# Altium project Ethernet_PCB.PrjPcb (part 2 of 2)

## Sheet Power Management.SchDoc
size A; SheetNumber: 4; SheetTotal: 7
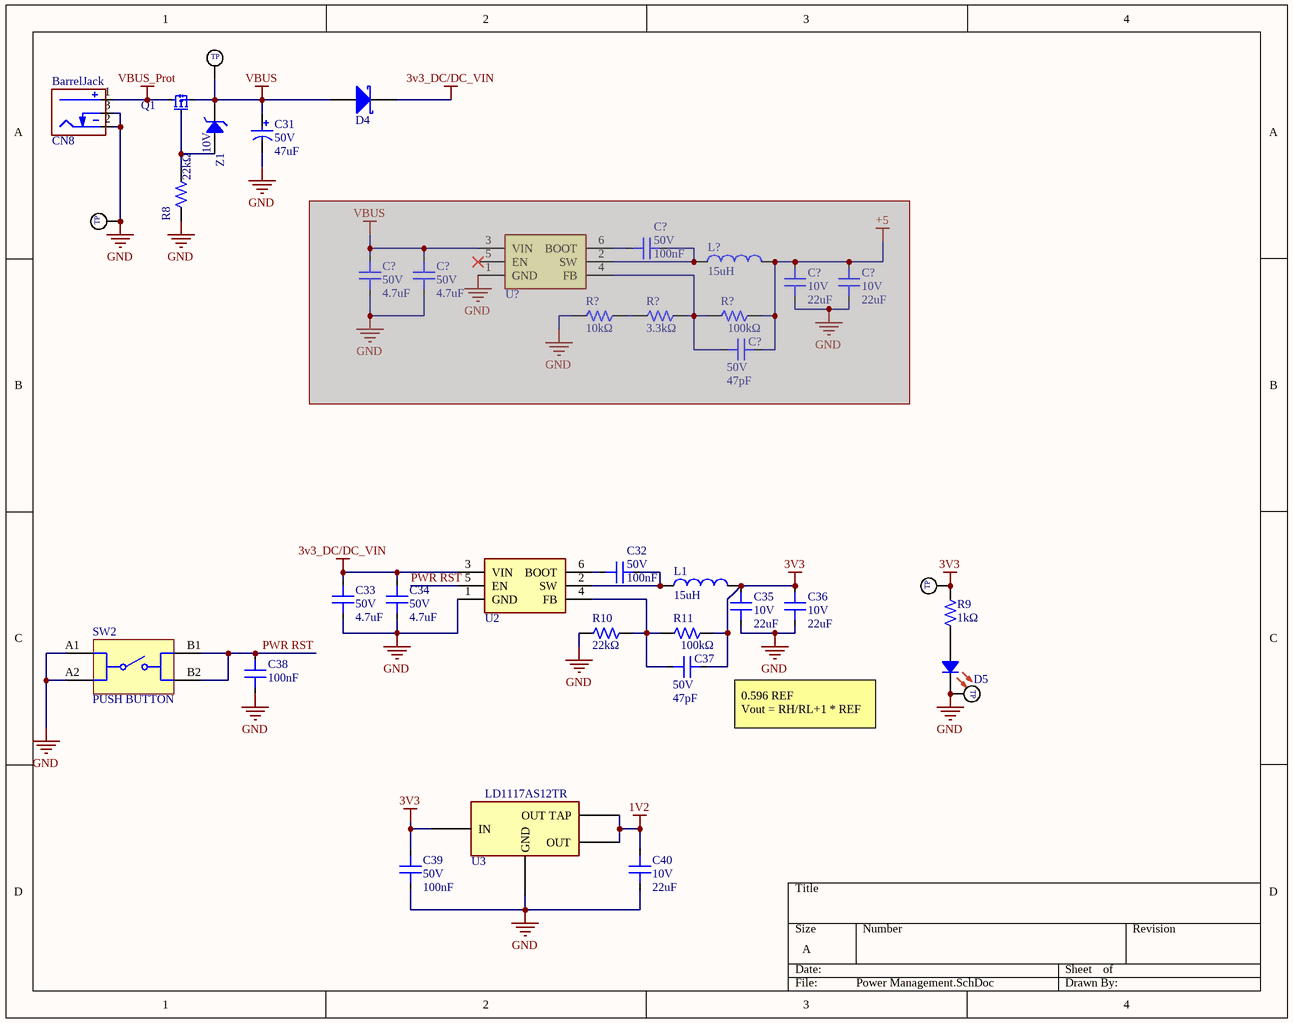
[diagram p4: Power Management.SchDoc]

### Parts
(Parts that share a designator on the sheet are numbered #1, #2 ... from top to bottom, then left to right.)
C31  Voltage Rating: 50V  Capacitance: 47uF  [CAP TH ALUM ELEC D6.30mm S2.50mm H11.00mm]  (hidden comment: CAP ALUM 47uF ±20% 50V TH)
C32  Voltage Rating: 50V  Capacitance: 100nF  [C_0603]  (hidden comment: CAP CER 100nF 50V X7R 0603)
C33  Voltage Rating: 50V  Capacitance: 4.7uF  [C_1206]  (hidden comment: CAP CER 4.7uF 50V X7R 1206)
C34  Voltage Rating: 50V  Capacitance: 4.7uF  [C_1206]  (hidden comment: CAP CER 4.7uF 50V X7R 1206)
C35  Voltage Rating: 10V  Capacitance: 22uF  [C_1206]  (hidden comment: CAP CER 22uF 10V X7R 1206)
C36  Voltage Rating: 10V  Capacitance: 22uF  [C_1206]  (hidden comment: CAP CER 22uF 10V X7R 1206)
C37  Voltage Rating: 50V  Capacitance: 47pF  [C_0603]  (hidden comment: CAP CER 47pF 50V C0G 0603)
C38  Capacitance: 100nF  [C_0603]  (hidden comment: CAP CER 100nF 50V X7R 0603)
C39  Voltage Rating: 50V  Capacitance: 100nF  [C_0603]  (hidden comment: CAP CER 100nF 50V X7R 0603)
C40  Voltage Rating: 10V  Capacitance: 22uF  [C_1206]  (hidden comment: CAP CER 22uF 10V X7R 1206)
C?#1  Voltage Rating: 50V  Capacitance: 100nF  [C_0603]  (hidden comment: CAP CER 100nF 50V X7R 0603)  (masked out: inside a compile mask, not in the netlist)
C?#2  Voltage Rating: 50V  Capacitance: 4.7uF  [C_1206]  (hidden comment: CAP CER 4.7uF 50V X7R 1206)  (masked out: inside a compile mask, not in the netlist)
C?#3  Voltage Rating: 50V  Capacitance: 4.7uF  [C_1206]  (hidden comment: CAP CER 4.7uF 50V X7R 1206)  (masked out: inside a compile mask, not in the netlist)
C?#4  Voltage Rating: 10V  Capacitance: 22uF  [C_1206]  (hidden comment: CAP CER 22uF 10V X7R 1206)  (masked out: inside a compile mask, not in the netlist)
C?#5  Voltage Rating: 10V  Capacitance: 22uF  [C_1206]  (hidden comment: CAP CER 22uF 10V X7R 1206)  (masked out: inside a compile mask, not in the netlist)
C?#6  Voltage Rating: 50V  Capacitance: 47pF  [C_0603]  (hidden comment: CAP CER 47pF 50V C0G 0603)  (masked out: inside a compile mask, not in the netlist)
CN8  CONN PWR JACK 2mm x 6.4mm TH R/A  [CONN_DC-POWER-JACK_TH_RA]  (value not drawn)
D4  DIODE SCHOTTKY 40V SOD-323  [SOD323]  (value not drawn)
D5  LED RED WATER CLEAR 0603 SMD  [LED_0603]  (value not drawn)
L1  Inductance: 15uH  [IND_SMD,4.7X4.7MM]  (hidden comment: FIXED IND 15uH 0.76A 149mΩ SMD,4.7x4.7mm)
L?  Inductance: 15uH  [IND_SMD,4.7X4.7MM]  (hidden comment: FIXED IND 15uH 0.76A 149mΩ SMD,4.7x4.7mm)  (masked out: inside a compile mask, not in the netlist)
Q1  MOSFET P-CH 30V 4A SOT-23  [SOT23]  (value not drawn)
R8  Resistance: 22kΩ  [R_0603]  (hidden comment: RES 22kΩ ±1% 100mW 0603)
R9  Resistance: 1kΩ  [R_0603]  (hidden comment: RES 1kΩ ±1% 100mW 0603)
R10  Resistance: 22kΩ  [R_0603]  (hidden comment: RES 22kΩ ±1% 100mW 0603)
R11  Resistance: 100kΩ  [R_0603]  (hidden comment: RES 100kΩ ±1% 100mW 0603)
R?#1  Resistance: 10kΩ  [R_0603]  (hidden comment: RES 10kΩ ±1% 100mW 0603)  (masked out: inside a compile mask, not in the netlist)
R?#2  Resistance: 3.3kΩ  [R_0603]  (hidden comment: RES 3.3kΩ ±1% 100mW 0603)  (masked out: inside a compile mask, not in the netlist)
R?#3  Resistance: 100kΩ  [R_0603]  (hidden comment: RES 100kΩ ±1% 100mW 0603)  (masked out: inside a compile mask, not in the netlist)
SW2  PUSH BUTTON  [Tact Switch 6X6X9.5MM]
TP1  TestPoint TH  [TESTPOINT_TH_MINIATURE]  (value not drawn)
TP2  TestPoint TH  [TESTPOINT_TH_MINIATURE]  (value not drawn)
TP3  TestPoint TH  [TESTPOINT_TH_MINIATURE]  (value not drawn)
TP4  TestPoint TH  [TESTPOINT_TH_MINIATURE]  (value not drawn)
U2  4.5-V to 28-V Input, 3-A Output, EMI-Friendly Synchronous Step-Down Converter  [TSOT-23-6]  (value not drawn)
U3  Low Dropout Fixed and Adjustable Positive Voltage Regulators  [SOT-223-4]  (value not drawn)
U?  4.5-V to 28-V Input, 3-A Output, EMI-Friendly Synchronous Step-Down Converter  [TSOT-23-6]  (value not drawn)  (masked out: inside a compile mask, not in the netlist)
Z1  Zener Voltage: 10V  [SOD123]  (hidden comment: DIODE ZENER 10V 500mW SOD-123)

### Nets
1V2: C40.2 U3.2(OUT) U3.4(OUT_TAP)  [project net VDD_1.2A]
3V3: C35.2 C36.2 C37.2 C39.2 L1.2 R9.1 R11.2 TP3.1 U3.3(IN)  [project net VDD33]
3v3_DC/DC_VIN: C33.1 C34.1 D4.2(K) U2.3(VIN)
GND: C31.2 C33.2 C34.2 C35.1 C36.1 C38.1 C39.1 C40.1 CN8.2(Outer) CN8.3(SW) D5.2 R8.1 R10.1 SW2.A1 SW2.A2 TP2.1 TP4.1 U2.1(GND) U3.1(GND)
VBUS: C31.1 D4.1(A) Q1.2(SOURCE) TP1.1 Z1.2
VBUS_Prot: CN8.1(Centre) Q1.3(DRAIN)
PWR RST: C38.2 SW2.B1 SW2.B2 U2.5(EN)
NetC32_1: C32.1 U2.6(BOOT)
NetC32_2: C32.2 L1.1 U2.2(SW)
NetC37_1: C37.1 R10.2 R11.1 U2.4(FB)
NetD5_1: D5.1 R9.2
NetQ1_1: Q1.1(GATE) R8.2 Z1.1

### Notes on the sheet
- 0.596 REF
  Vout = RH/RL+1 * REF
- (in symbol 5000) TP

### Library data of the parts
C31 = ERS1HM470E110T: 47uF 50V Aluminum Electrolytic Capacitors Through Hole,D6.3xL11mm 5000hrs@105℃; Manufacturer: AISHI; Symbol Path 1: Symbols\Standard.SchLib; Unit Price (USD): 0.0351; MPN: ERS1HM470E110T; LCSC Part #: C106665; Package: THROUGH HOLE,D6.3XL11MM; JLC Part Type: Extended; LCSC Stock: 162380; JLC Stock: 171488; MOQ: 20; Datasheet: https://datasheet.lcsc.com/datasheet/pdf/b0168805bce6925b8870af550341b247.pdf?productCode=C106665; URL: https://www.lcsc.com/product-detail/C106665.html; Status: ok; Tolerance: ±20%; Lifetime: 5000hrs@105℃; Subcategory: Aluminum Electrolytic Capacitors
C32 C39 C?#1 = C14663: 100nF ±10% 50V Ceramic Capacitor X7R 0603; Manufacturer: YAGEO; MPN: CC0603KRX7R9BB104; Symbol Path 1: Symbols\Standard.SchLib; Unit Price (USD): 0.0175; LCSC Part #: C14663; Package: 0603; JLC Part Type: Basic; LCSC Stock: 10701000; JLC Stock: 72739428; MOQ: 50; Datasheet: https://datasheet.lcsc.com/datasheet/pdf/23ccee80ee542e7cf156a772bb589942.pdf?productCode=C14663; URL: https://www.lcsc.com/product-detail/C14663.html; Status: ok; Tolerance: ±10%; TempCo: X7R
C33 C34 C?#2 C?#3 = C29823: 4.7uF ±10% 50V Ceramic Capacitor X7R 1206; Manufacturer: FH; MPN: 1206B475K500NT; Symbol Path 1: Symbols\Standard.SchLib; Unit Price (USD): 0.2723; LCSC Part #: C29823; Package: 1206; JLC Part Type: Basic; LCSC Stock: 428640; JLC Stock: 942034; MOQ: 10; Datasheet: https://datasheet.lcsc.com/datasheet/pdf/09fe2daf22580a99fa7fea93ccb20fb7.pdf?productCode=C29823; URL: https://www.lcsc.com/product-detail/C29823.html; Status: ok; Tolerance: ±10%; TempCo: X7R
C35 C36 C40 C?#4 C?#5 = C87996: 22uF ±10% 10V Ceramic Capacitor X7R 1206; Manufacturer: Samsung Electro-Mechanics; MPN: CL31B226KPHNNNE; Symbol Path 1: Symbols\Standard.SchLib; Unit Price (USD): 0.1794; LCSC Part #: C87996; Package: 1206; JLC Part Type: Extended; LCSC Stock: 223920; JLC Stock: 305356; MOQ: 5; Datasheet: https://datasheet.lcsc.com/datasheet/pdf/02336ea48ea44ca18c72517dd3cb7b47.pdf?productCode=C87996; URL: https://www.lcsc.com/product-detail/C87996.html; Status: ok; Tolerance: ±10%; TempCo: X7R
C37 C?#6 = C1671: 47pF ±5% 50V Ceramic Capacitor C0G 0603; Manufacturer: Samsung Electro-Mechanics; MPN: CL10C470JB8NNNC; Symbol Path 1: Symbols\Standard.SchLib; Unit Price (USD): 0.011; LCSC Part #: C1671; Package: 0603; JLC Part Type: Basic; LCSC Stock: 658700; JLC Stock: 1229214; MOQ: 100; Datasheet: https://datasheet.lcsc.com/datasheet/pdf/02336ea48ea44ca18c72517dd3cb7b47.pdf?productCode=C1671; URL: https://www.lcsc.com/product-detail/C1671.html; Status: ok; Tolerance: ±5%; TempCo: C0G
C38 = CC0603KRX7R9BB104: 100nF ±10% 50V Ceramic Capacitor X7R 0603; Manufacturer: YAGEO; Symbol Path 1: Symbols\Standard.SchLib; Unit Price (USD): 0.0175; Voltage Rating: 50V; MPN: CC0603KRX7R9BB104; LCSC Part #: C14663; Package: 0603; JLC Part Type: Basic; LCSC Stock: 10701000; JLC Stock: 72739428; MOQ: 50; Datasheet: https://datasheet.lcsc.com/datasheet/pdf/23ccee80ee542e7cf156a772bb589942.pdf?productCode=C14663; URL: https://www.lcsc.com/product-detail/C14663.html; Status: ok; Tolerance: ±10%; TempCo: X7R
CN8 = DC-005-A200: Power Barrel Connector Jack 2mm ID 6.4mm OD Through Hole, Right Angle; Manufacturer: XUNPU; Symbol Path 1: Symbols\Standard_CONN.SchLib; Unit Price (USD): 0.1442; MPN: DC-005-A200; LCSC Part #: C720557; Package: THROUGH HOLE; JLC Part Type: Extended; LCSC Stock: 71145; JLC Stock: 71145; MOQ: 5; Datasheet: https://datasheet.lcsc.com/datasheet/pdf/c2acc7caa29ac1d040564d55b702c9cb.pdf?productCode=C720557; URL: https://www.lcsc.com/product-detail/C720557.html; Status: ok
D4 = 1N5819WS: Diode 40V 1A Surface Mount SOD-323; Manufacturer: Guangdong Hottech; Symbol Path 1: Symbols\Standard.SchLib; Unit Price (USD): 0.0139; Forward Voltage: 600mV@1A; MPN: 1N5819WS; LCSC Part #: C191023; Package: SOD-323; JLC Part Type: Basic; LCSC Stock: 4984450; JLC Stock: 5626571; MOQ: 50; Datasheet: https://datasheet.lcsc.com/datasheet/pdf/c7a6590686b7be2f86b8eed4480e569c.pdf?productCode=C191023; URL: https://www.lcsc.com/product-detail/C191023.html; Status: ok; Voltage Rating: 40V; Current Rating: 1A; Subcategory: Schottky
D5 = XL-1608SURC-06: Red 625nm LED Indication - Discrete 2.3V 0603; Manufacturer: XINGLIGHT; Symbol Path 1: Symbols\Standard.SchLib; Unit Price (USD): 0.0035; Forward Current: 20mA; Luminous: 225mcd; MPN: XL-1608SURC-06; LCSC Part #: C965799; Package: 0603; JLC Part Type: Extended; LCSC Stock: 7400800; JLC Stock: 7400861; MOQ: 100; Datasheet: https://datasheet.lcsc.com/datasheet/pdf/8b84af6e65674f776ac713f2807c626a.pdf?productCode=C965799; URL: https://www.lcsc.com/product-detail/C965799.html; Status: ok; Colour: Red; Forward Voltage: 2.3V
L1 L? = XRRH4D28-150M: Manufacturer: XR; Symbol Path 1: Symbols\Standard.SchLib; Unit Price (USD): 0.1057; Tolerance: ±20%; Rated Current: 760mA; MPN: XRRH4D28-150M; LCSC Part #: C5351438; Package: SMD,4.7X4.7MM; JLC Part Type: Extended; LCSC Stock: 640; JLC Stock: 640; MOQ: 5; Datasheet: https://datasheet.lcsc.com/datasheet/pdf/86c679cf93a94dd1d57823f3427e60b9.pdf?productCode=C5351438; URL: https://www.lcsc.com/product-detail/C5351438.html; Status: ok; DC Resistance: 149mΩ
Q1 = AO3401A: 30V 4A Surface Mount SOT-23; Manufacturer: AOS; Symbol Path 1: Symbols\Standard.SchLib; Unit Price (USD): 0.0951; Rds: 47mΩ@10V;60mΩ@4.5V;85mΩ@2.5V; Vgs(th): 900mV; MPN: AO3401A; LCSC Part #: C15127; Package: SOT-23; JLC Part Type: Basic; LCSC Stock: 115510; JLC Stock: 469891; MOQ: 5; Datasheet: https://datasheet.lcsc.com/datasheet/pdf/fee353dd1e9e0bc90b295f14f381aa4c.pdf?productCode=C15127; URL: https://www.lcsc.com/product-detail/C15127.html; Status: ok; Vds: 30V; Id: 4A
R8 R10 = C31850: 22kΩ ±1% 100mW 0603 Thick Film Resistor; MPN: 0603WAF2202T5E; Manufacturer: UNI-ROYAL; Symbol Path 1: Symbols\Standard.SchLib; Unit Price (USD): 0.0067; Voltage Rating: 75V; TempCo: ±100ppm/℃; LCSC Part #: C31850; Package: 0603; Datasheet: https://datasheet.lcsc.com/datasheet/pdf/0a975aaa49b7c97f38a963127be4a823.pdf?productCode=C31850; Power: 100mW; JLC Part Type: Basic; LCSC Stock: 3044300; JLC Stock: 4293246; MOQ: 100; URL: https://www.lcsc.com/product-detail/C31850.html; Status: ok; Tolerance: ±1%; Composition: Thick Film Resistor
R9 = 0603WAF1001T5E: 1kΩ ±1% 100mW 0603 Thick Film Resistor; Manufacturer: UNI-ROYAL; Symbol Path 1: Symbols\Standard.SchLib; Unit Price (USD): 0.0058; Voltage Rating: 75V; TempCo: ±100ppm/℃; MPN: 0603WAF1001T5E; Package: 0603; Datasheet: https://datasheet.lcsc.com/datasheet/pdf/0a975aaa49b7c97f38a963127be4a823.pdf?productCode=C21190; Power: 100mW; LCSC Part #: C21190; JLC Part Type: Basic; LCSC Stock: 7626000; JLC Stock: 31254885; MOQ: 100; URL: https://www.lcsc.com/product-detail/C21190.html; Status: ok; Tolerance: ±1%; Composition: Thick Film Resistor
R11 R?#3 = C25803: 100kΩ ±1% 100mW 0603 Thick Film Resistor; MPN: 0603WAF1003T5E; Manufacturer: UNI-ROYAL; Symbol Path 1: Symbols\Standard.SchLib; Unit Price (USD): 0.0042; Voltage Rating: 75V; TempCo: ±100ppm/℃; LCSC Part #: C25803; Package: 0603; Datasheet: https://datasheet.lcsc.com/datasheet/pdf/0a975aaa49b7c97f38a963127be4a823.pdf?productCode=C25803; Power: 100mW; JLC Part Type: Basic; LCSC Stock: 13059500; JLC Stock: 21549170; MOQ: 100; URL: https://www.lcsc.com/product-detail/C25803.html; Status: ok; Tolerance: ±1%; Composition: Thick Film Resistor
R?#1 = 0603WAF1002T5E: 10kΩ ±1% 100mW 0603 Thick Film Resistor; Manufacturer: UNI-ROYAL; Symbol Path 1: Symbols\Standard.SchLib; Unit Price (USD): 0.0067; Voltage Rating: 75V; TempCo: ±100ppm/℃; MPN: 0603WAF1002T5E; Package: 0603; Datasheet: https://datasheet.lcsc.com/datasheet/pdf/0a975aaa49b7c97f38a963127be4a823.pdf?productCode=C25804; Power: 100mW; LCSC Part #: C25804; JLC Part Type: Basic; LCSC Stock: 0; JLC Stock: 6329063; MOQ: 100; URL: https://www.lcsc.com/product-detail/C25804.html; Status: ok; Tolerance: ±1%; Composition: Thick Film Resistor
R?#2 = 0603WAF3301T5E: 3.3kΩ ±1% 100mW 0603 Thick Film Resistor; Manufacturer: UNI-ROYAL; Symbol Path 1: Symbols\Standard.SchLib; Unit Price (USD): 0.005; Voltage Rating: 75V; TempCo: ±100ppm/℃; MPN: 0603WAF3301T5E; Package: 0603; Datasheet: https://datasheet.lcsc.com/datasheet/pdf/0a975aaa49b7c97f38a963127be4a823.pdf?productCode=C22978; Power: 100mW; LCSC Part #: C22978; JLC Part Type: Basic; LCSC Stock: 4987900; JLC Stock: 7018614; MOQ: 100; URL: https://www.lcsc.com/product-detail/C22978.html; Status: ok; Tolerance: ±1%; Composition: Thick Film Resistor
SW2 = SH-6X6X8H-CJ: SWITCH PUSH BUTTON 2X2 6X6X9.5MM; Supplier 1: LCSC; Supplier Part Number 1: C42416249; ComponentLink1Description: MAKERS; ComponentLink1URL: https://makerselectronics.com/product/mini-push-button-4-pin-6x6x9-5mm
TP1-TP4 = 5000: TestPoint TH MINIATURE; Supplier 1: Digikey; Supplier Part Number 1: 36-5000-ND; Supplier 2: LCSC; Supplier Part Number 2: C5277086
U2 U? = TPS54302DDCR: Buck Switching Regulator IC Adjustable 1 Output 3A TSOT-23-6; Manufacturer: TI; Symbol Path 1: Symbols\Standard_ICs.SchLib; Unit Price (USD): 0.3033; Input Voltage: 4.5V~28V; MPN: TPS54302DDCR; LCSC Part #: C311983; Package: TSOT-23-6; JLC Part Type: Extended; LCSC Stock: 4335; JLC Stock: 5216; MOQ: 5; Datasheet: https://datasheet.lcsc.com/datasheet/pdf/dd7a4984f2d3ca9a2264b937537aa471.pdf?productCode=C311983; URL: https://www.lcsc.com/product-detail/C311983.html; Status: ok; Subcategory: Voltage Regulators - DC DC Switching Regulators; Output Current: 3A
U3 = LD1117AS12TR: Manufacturer: ST; Symbol Path 1: Symbols\Standard_ICs.SchLib; Unit Price (USD): 0.3055; Output Voltage: 1.2V; Output Current: 1.2A; Input Voltage: 10V; MPN: LD1117AS12TR; LCSC Part #: C98193; Package: SOT-223; JLC Part Type: Extended; LCSC Stock: 2645; JLC Stock: 2647; MOQ: 5; Datasheet: https://datasheet.lcsc.com/datasheet/pdf/bad2b7c9a0104f7f93b9ca5f4bf0c704.pdf?productCode=C98193; URL: https://www.lcsc.com/product-detail/C98193.html; Status: ok; Subcategory: Voltage Regulators - Linear, Low Drop Out (LDO) Regulators
Z1 = MM1Z10B: Zener Diode Independent 10V 500mW Surface Mount SOD-123; Manufacturer: R+O; Symbol Path 1: Symbols\Standard.SchLib; Unit Price (USD): 0.0253; MPN: MM1Z10B; LCSC Part #: C22466341; Package: SOD-123; JLC Part Type: Extended; LCSC Stock: 58240; JLC Stock: 58248; MOQ: 20; Datasheet: https://datasheet.lcsc.com/datasheet/pdf/907cba31244dca3d738fcc4264c58834.pdf?productCode=C22466341; URL: https://www.lcsc.com/product-detail/C22466341.html; Status: ok; Subcategory: Zener

## Sheet USB Connectors.SchDoc
size A; SheetNumber: 5; SheetTotal: 7
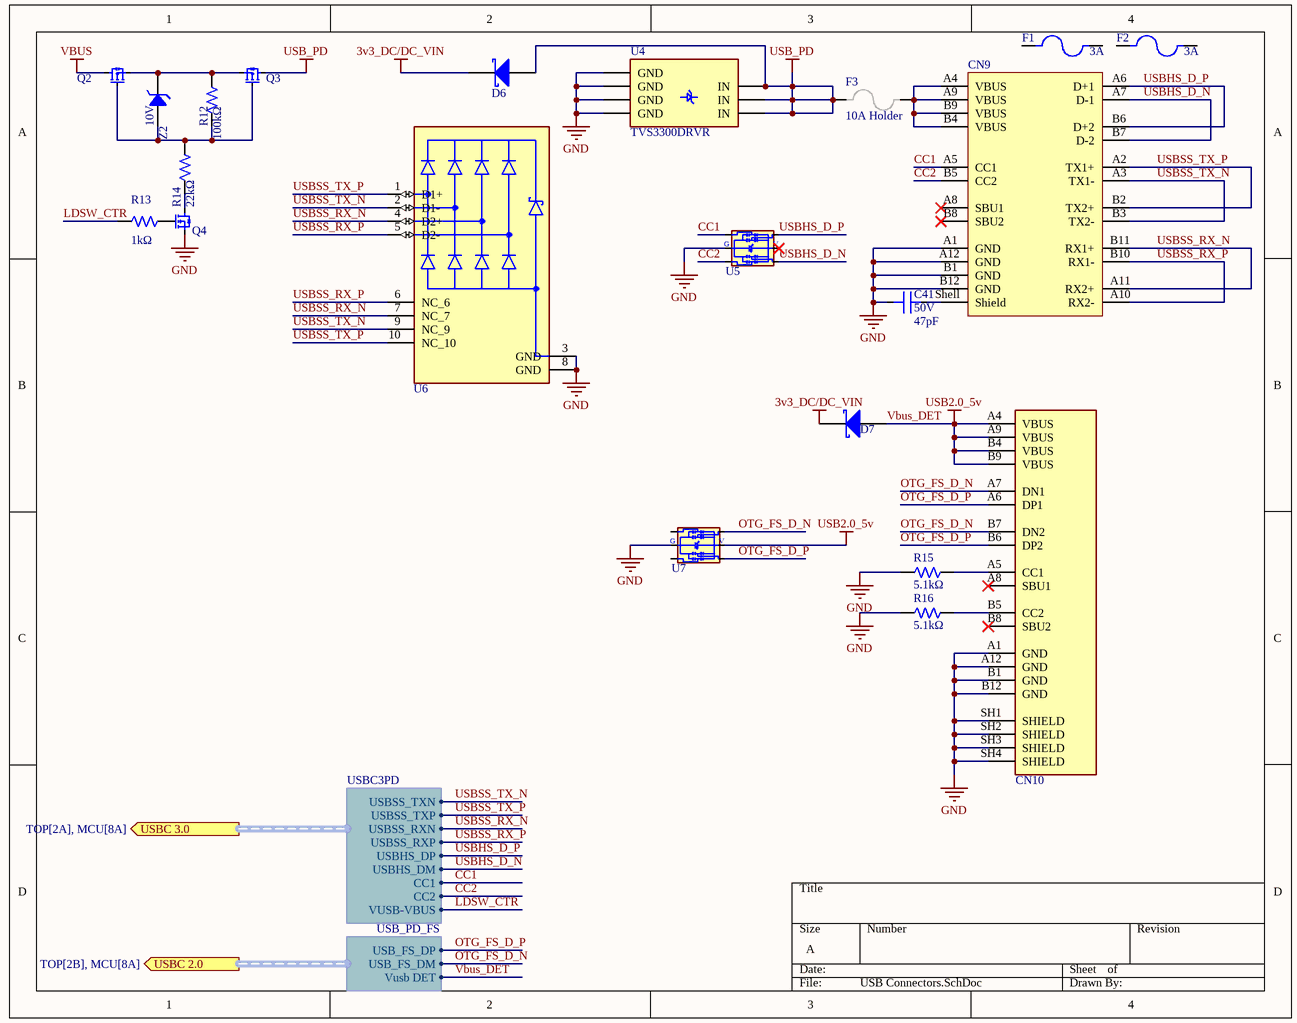
[diagram p5: USB Connectors.SchDoc]

### Parts
C41  Voltage Rating: 50V  Capacitance: 47pF  [C_0603]  (hidden comment: CAP CER 47pF 50V C0G 0603)
CN9  CONN RCPT USB 3.1 Type-C 24POS SMD R/A  [CONN_TYPE-C_24P_SMD_RA]  (value not drawn)
CN10  CONN RCPT USB 3.1 Type-C 16POS TH R/A  [CONN_TYPE-C_16P_TH_RA]  (value not drawn)
D6  DIODE SCHOTTKY 40V SOD-323  [SOD323]  (value not drawn)
D7  DIODE SCHOTTKY 40V SOD-323  [SOD323]  (value not drawn)
F1  3A  (mechanical)
F2  3A  (mechanical)
F3  10A Holder  [FUSE_SMD 2410 HOLDER]
Q2  MOSFET P-CH 30V 4A SOT-23  [SOT23]  (value not drawn)
Q3  MOSFET P-CH 30V 4A SOT-23  [SOT23]  (value not drawn)
Q4  MOSFET N-CH 30V SOT-23-3L  [SOT23]  (value not drawn)
R12  Resistance: 100kΩ  [R_0603]  (hidden comment: RES 100kΩ ±1% 100mW 0603)
R13  Resistance: 1kΩ  [R_0603]  (hidden comment: RES 1kΩ ±1% 100mW 0603)
R14  Resistance: 22kΩ  [R_0603]  (hidden comment: RES 22kΩ ±1% 100mW 0603)
R15  Resistance: 5.1kΩ  [R_0603]  (hidden comment: RES 5.1kΩ ±1% 100mW 0603)
R16  Resistance: 5.1kΩ  [R_0603]  (hidden comment: RES 5.1kΩ ±1% 100mW 0603)
U4  TVS3300DRVR  [WSON-6(2x2)]
U5  ESD DIODE 5.5VWM 18VC SOT-23-6  [SOT-23-6]  (value not drawn)
U6  TVS DIODE 5.5VWM 14VC USON-10(1x2.5)  [USON-10]  (value not drawn)
U7  ESD DIODE 5.5VWM 18VC SOT-23-6  [SOT-23-6]  (value not drawn)
Z2  Zener Voltage: 10V  [SOD123]  (hidden comment: DIODE ZENER 10V 500mW SOD-123)

### Ports
USBC 2.0 (out, harness USB_PD_FS, see TOP[2B], MCU[8A]), USBC 3.0 (out, harness USBC3PD, see TOP[2A], MCU[8A])

### Harnesses
USBC3PD: USBHS_DM, USBHS_DP, USBSS_RXP, USBSS_RXN, USBSS_TXP, USBSS_TXN, CC1, CC2, VUSB-VBUS
USB_PD_FS: USB_FS_DP, USB_FS_DM, Vusb DET

### Nets
3v3_DC/DC_VIN: D6.2(K) D7.2(K)
GND: C41.1 CN9.A1(GND) CN9.A12(GND) CN9.B1(GND) CN9.B12(GND) CN10.A1(GND) CN10.A12(GND) CN10.B1(GND) CN10.B12(GND) CN10.SH1(SHIELD) CN10.SH2(SHIELD) CN10.SH3(SHIELD) CN10.SH4(SHIELD) Q4.2(SOURCE) R15.1 R16.1 U4.1(GND) U4.2(GND) U4.3(GND) U4.7(GND) U5.2 U6.3(GND) U6.8(GND) U7.2
USB_PD: D6.1(A) F3.1 Q3.3(DRAIN) U4.4(IN) U4.5(IN) U4.6(IN)
VBUS: Q2.3(DRAIN)
Vbus_DET: CN10.A4(VBUS) CN10.A9(VBUS) CN10.B4(VBUS) CN10.B9(VBUS) D7.1(A) U7.5 ; port USBC 2.0.Vusb DET  [also labelled USB2.0_5v]
CC1: CN9.A5(CC1) U5.1 ; port USBC 3.0.CC1
CC2: CN9.B5(CC2) U5.3 ; port USBC 3.0.CC2
LDSW_CTR: R13.1 ; port USBC 3.0.VUSB-VBUS
OTG_FS_D_N: CN10.A7(DN1) CN10.B7(DN2) U7.6 ; port USBC 2.0.USB_FS_DM
OTG_FS_D_P: CN10.A6(DP1) CN10.B6(DP2) U7.4 ; port USBC 2.0.USB_FS_DP
USBHS_D_N: CN9.A7(D-1) CN9.B7(D-2) U5.4 ; port USBC 3.0.USBHS_DM
USBHS_D_P: CN9.A6(D+1) CN9.B6(D+2) U5.6 ; port USBC 3.0.USBHS_DP
USBSS_RX_N: CN9.A11(RX2+) CN9.B11(RX1+) U6.4(D2+) U6.7(NC_7) ; port USBC 3.0.USBSS_RXN
USBSS_RX_P: CN9.A10(RX2-) CN9.B10(RX1-) U6.5(D2-) U6.6(NC_6) ; port USBC 3.0.USBSS_RXP
USBSS_TX_N: CN9.A3(TX1-) CN9.B3(TX2-) U6.2(D1-) U6.9(NC_9) ; port USBC 3.0.USBSS_TXN
USBSS_TX_P: CN9.A2(TX1+) CN9.B2(TX2+) U6.1(D1+) U6.10(NC_10) ; port USBC 3.0.USBSS_TXP
NetC41_2: C41.2 CN9.Shell(Shield)
NetCN9_A4: CN9.A4(VBUS) CN9.A9(VBUS) CN9.B4(VBUS) CN9.B9(VBUS) F3.2
NetCN10_A5: CN10.A5(CC1) R15.2
NetCN10_B5: CN10.B5(CC2) R16.2
NetQ2_1: Q2.1(GATE) Q3.1(GATE) R12.1 R14.2 Z2.1
NetQ2_2: Q2.2(SOURCE) Q3.2(SOURCE) R12.2 Z2.2
NetQ4_1: Q4.1(GATE) R13.2
NetQ4_3: Q4.3(DRAIN) R14.1

Not connected (* = marked no-connect by the designer): CN9 A8(SBU1)* B8(SBU2)*; CN10 A8(SBU1)* B8(SBU2)*; F1 1 2; F2 1 2; U5 5*; U7 1 3

### Notes on the sheet
- (in symbol AOZ8904CIL) G; V

### Library data of the parts
C41 = C1671: as C37 on sheet Power Management; LCSC Part #: C1671; Package: 0603; JLC Part Type: Basic; LCSC Stock: 658700; JLC Stock: 1229214; MOQ: 100; Datasheet: https://datasheet.lcsc.com/datasheet/pdf/02336ea48ea44ca18c72517dd3cb7b47.pdf?productCode=C1671; URL: https://www.lcsc.com/product-detail/C1671.html; Status: ok; Tolerance: ±5%; TempCo: C0G
CN9 = TYPE-C 24P QT 143: USB-C (USB TYPE-C) Receptacle Connector 24 Position Surface Mount, Right Angle; Manufacturer: SHOU HAN; Symbol Path 1: Symbols\Standard.SchLib; Unit Price (USD): 0.4524; Positions: 24P; MPN: TYPE-C 24P QT 143; LCSC Part #: C5156605; Package: SMD; JLC Part Type: Extended; LCSC Stock: 27844; JLC Stock: 27844; MOQ: 1; Datasheet: https://datasheet.lcsc.com/datasheet/pdf/5e2518a21a03f1086118bfdc224ba041.pdf?productCode=C5156605; URL: https://www.lcsc.com/product-detail/C5156605.html; Status: ok; Mounting Type: Surface Mount, Right Angle; Type: Type-C
CN10 = TYPEC-306DDW-ARP16: USB-C (USB TYPE-C) Receptacle Connector 16 Position Right Angle; Manufacturer: XUNPU; Symbol Path 1: Symbols\Standard_CONN.SchLib; Unit Price (USD): 0.8482; Positions: 16P; MPN: TYPEC-306DDW-ARP16; LCSC Part #: C2840393; Package: THROUGH HOLE,RIGHT ANGLE; JLC Part Type: Extended; LCSC Stock: 2945; JLC Stock: 2962; MOQ: 1; Datasheet: https://datasheet.lcsc.com/datasheet/pdf/69a9ba2274492f854bbf6d61200cd4bb.pdf?productCode=C2840393; URL: https://www.lcsc.com/product-detail/C2840393.html; Status: ok; Mounting Type: Right Angle; Type: Type-C
D6 D7 = 1N5819WS: as D4 on sheet Power Management; MPN: 1N5819WS; LCSC Part #: C191023; Package: SOD-323; JLC Part Type: Basic; LCSC Stock: 4984450; JLC Stock: 5626571; MOQ: 50; Datasheet: https://datasheet.lcsc.com/datasheet/pdf/c7a6590686b7be2f86b8eed4480e569c.pdf?productCode=C191023; URL: https://www.lcsc.com/product-detail/C191023.html; Status: ok; Voltage Rating: 40V; Current Rating: 1A; Subcategory: Schottky
F1 F2 = JFC2410-1300FS: FUSE BRD MNT 3A 2410; Supplier 1: LCSC; Supplier Part Number 1: C2994709; ComponentLink1Description: Makers; ComponentLink1URL: https://makerselectronics.com/product/smd-fuse-fast-blow-3a-2410-50a-6-1x2-69x2-69mm/
F3 = 01550900M: FUSE BLOK CARTRIDGE 125V 10A SMD; Supplier 1: DigiKey; Supplier Part Number 1: F1889-ND; Supplier 2: LCSC; Supplier Part Number 2: C108518
Q2 Q3 = AO3401A: as Q1 on sheet Power Management; MPN: AO3401A; LCSC Part #: C15127; Package: SOT-23; JLC Part Type: Basic; LCSC Stock: 115510; JLC Stock: 469891; MOQ: 5; Datasheet: https://datasheet.lcsc.com/datasheet/pdf/fee353dd1e9e0bc90b295f14f381aa4c.pdf?productCode=C15127; URL: https://www.lcsc.com/product-detail/C15127.html; Status: ok; Vds: 30V; Id: 4A
Q4 = AO3400A: N-Channel 30V Surface Mount SOT-23-3L; Manufacturer: AOS; Symbol Path 1: Symbols\Standard.SchLib; Unit Price (USD): 0.0849; Id: 5.7A; Rds: 48mΩ@2.5V; Vgs(th): 1.45V; Supplier 1: DigiKey; Supplier Part Number 1: 785-1000-1-ND; Supplier 2: LCSC; Supplier Part Number 2: C20917; MPN: AO3400A; LCSC Part #: C20917; Package: SOT-23; JLC Part Type: Basic; LCSC Stock: 656120; JLC Stock: 1217370; MOQ: 5; Datasheet: https://datasheet.lcsc.com/datasheet/pdf/130876b936da464599428c58fd8de8f6.pdf?productCode=C20917; URL: https://www.lcsc.com/product-detail/C20917.html; Status: ok; Type: N-Channel; Vds: 30V
R12 = C25803: as R11 on sheet Power Management; LCSC Part #: C25803; Package: 0603; Datasheet: https://datasheet.lcsc.com/datasheet/pdf/0a975aaa49b7c97f38a963127be4a823.pdf?productCode=C25803; Power: 100mW; JLC Part Type: Basic; LCSC Stock: 13059500; JLC Stock: 21549170; MOQ: 100; URL: https://www.lcsc.com/product-detail/C25803.html; Status: ok; Tolerance: ±1%; Composition: Thick Film Resistor
R13 = 0603WAF1001T5E: as R9 on sheet Power Management; MPN: 0603WAF1001T5E; Package: 0603; Datasheet: https://datasheet.lcsc.com/datasheet/pdf/0a975aaa49b7c97f38a963127be4a823.pdf?productCode=C21190; Power: 100mW; LCSC Part #: C21190; JLC Part Type: Basic; LCSC Stock: 7626000; JLC Stock: 31254885; MOQ: 100; URL: https://www.lcsc.com/product-detail/C21190.html; Status: ok; Tolerance: ±1%; Composition: Thick Film Resistor
R14 = C31850: as R8 on sheet Power Management; LCSC Part #: C31850; Package: 0603; Datasheet: https://datasheet.lcsc.com/datasheet/pdf/0a975aaa49b7c97f38a963127be4a823.pdf?productCode=C31850; Power: 100mW; JLC Part Type: Basic; LCSC Stock: 3044300; JLC Stock: 4293246; MOQ: 100; URL: https://www.lcsc.com/product-detail/C31850.html; Status: ok; Tolerance: ±1%; Composition: Thick Film Resistor
R15 R16 = 0603WAF5101T5E: 5.1kΩ ±1% 100mW 0603 Thick Film Resistor; Manufacturer: UNI-ROYAL; Symbol Path 1: Symbols\Standard.SchLib; Unit Price (USD): 0.0026; Voltage Rating: 75V; TempCo: ±100ppm/℃; MPN: 0603WAF5101T5E; Package: 0603; Datasheet: https://datasheet.lcsc.com/datasheet/pdf/0a975aaa49b7c97f38a963127be4a823.pdf?productCode=C23186; Power: 100mW; LCSC Part #: C23186; JLC Part Type: Basic; LCSC Stock: 11090800; JLC Stock: 15519253; MOQ: 100; URL: https://www.lcsc.com/product-detail/C23186.html; Status: ok; Tolerance: ±1%; Composition: Thick Film Resistor
U4 = TVS3300DRVR: Surge Protection IC Surface Mount WSON-6(2x2); Manufacturer: TI; Symbol Path 1: Symbols\Standard_ICs.SchLib; Unit Price (USD): 0.5261; MPN: TVS3300DRVR; LCSC Part #: C2863624; Package: WSON-6(2x2); JLC Part Type: Extended; LCSC Stock: 353; JLC Stock: 353; MOQ: 1; Datasheet: https://www.ti.com/cn/lit/ds/symlink/tvs3300.pdf; URL: https://www.lcsc.com/product-detail/C2863624.html; Status: ok; Category: Circuit Protection; Subcategory: Surge Suppression ICs
U5 U7 = AOZ8904CIL: 18VC Clamp 4A@8/20us Ipp ESD DIODE SOT-23-6; Manufacturer: AOS; Symbol Path 1: Symbols\Standard.SchLib; Unit Price (USD): 0.1038; Reverse Standoff: 5.5V; Breakdown: 6.6V; Clamping: 18V; Channels: 4; Power: 50W; MPN: AOZ8904CIL; LCSC Part #: C2649893; Package: SOT-23-6; JLC Part Type: Extended; LCSC Stock: 22685; JLC Stock: 22688; MOQ: 5; Datasheet: https://datasheet.lcsc.com/datasheet/pdf/ff96264e99333206af656f0798b8a3ce.pdf?productCode=C2649893; URL: https://www.lcsc.com/product-detail/C2649893.html; Status: ok
U6 = TPD4E05U06DQAR: 14VC Clamp 2.5A@8/20us Ipp TVS DIODE USON-10(1x2.5); Manufacturer: TI; Symbol Path 1: Symbols\Standard.SchLib; Unit Price (USD): 0.0873; Reverse Standoff: 5.5V; Breakdown: 6.5V; Clamping: 14V; Channels: 4; Polarity: Unidirectional; Power: 40W@8/20us; MPN: TPD4E05U06DQAR; LCSC Part #: C138714; Package: USON-10(1x2.5); JLC Part Type: Extended; LCSC Stock: 52940; JLC Stock: 53051; MOQ: 5; Datasheet: https://datasheet.lcsc.com/datasheet/pdf/86fce5e377410b6c2d1b0526f306f55e.pdf?productCode=C138714; URL: https://www.lcsc.com/product-detail/C138714.html; Status: ok
Z2 = MM1Z10B: as Z1 on sheet Power Management; MPN: MM1Z10B; LCSC Part #: C22466341; Package: SOD-123; JLC Part Type: Extended; LCSC Stock: 58240; JLC Stock: 58248; MOQ: 20; Datasheet: https://datasheet.lcsc.com/datasheet/pdf/907cba31244dca3d738fcc4264c58834.pdf?productCode=C22466341; URL: https://www.lcsc.com/product-detail/C22466341.html; Status: ok; Subcategory: Zener

## Sheet Documentation.SchDoc
size A4; SheetNumber: 1; SheetTotal: 7
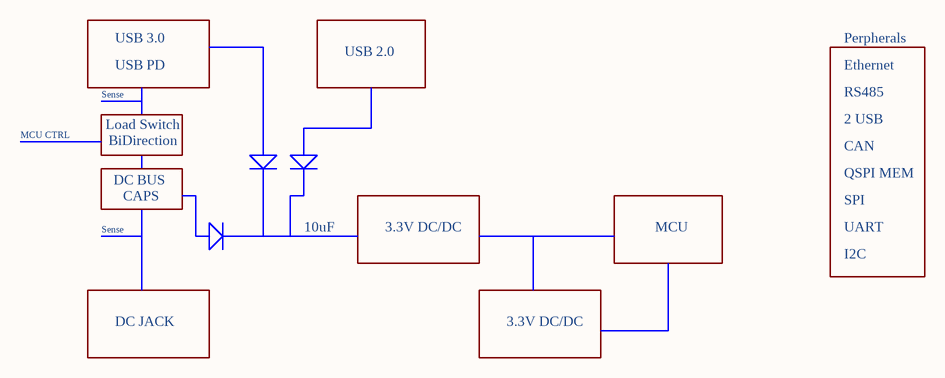
[diagram p6: Documentation.SchDoc]

### Notes on the sheet
- USB 3.0
- Perpherals
- Sense
- USB PD
- USB 2.0
- Ethernet
- RS485
- MCU CTRL
- Load Switch
- BiDirection
- DC BUS
- 2 USB
- QSPI MEM
- CAN
- CAPS
- 10uF
- 3.3V DC/DC
- MCU
- SPI
- UART
- I2C
- DC JACK

## Nets that join several sheets
3v3_DC/DC_VIN: Power Management (C33.1 C34.1 D4.2 U2.3), USB Connectors (D6.2 D7.2)
GND: Communication Connectors (20 pins), MCU (47 pins), Memory (14 pins), Power Management (19 pins), USB Connectors (24 pins)
VBUS: MCU (D1.2 R6.2), Power Management (5 pins), USB Connectors (Q2.3)
Vbus_DET: MCU (U1.88), USB Connectors (6 pins)
VBUS_Prot: Communication Connectors (CN14.1 CN15.1), Power Management (CN8.1 Q1.3)
VDD33: Communication Connectors (15 pins), MCU (36 pins), Memory (10 pins), Power Management (9 pins)
VDD_1.2A: MCU (8 pins), Power Management (C40.2 U3.2 U3.4)
CAN2_RX / AF9: Communication Connectors (U14.4), MCU (U1.65)
CAN2_TX / AF9: Communication Connectors (U14.1), MCU (U1.66)
CAN3_RX/AF2: Communication Connectors (U12.4), MCU (U1.109)
CAN3_TX/AF2: Communication Connectors (U12.1), MCU (U1.108)
CC1: MCU (U1.115), USB Connectors (CN9.A5 U5.1)
CC2: MCU (U1.116), USB Connectors (CN9.B5 U5.3)
DIR_EN1: Communication Connectors (U18.2 U18.3), MCU (U1.71)
DIR_EN2: Communication Connectors (U16.2 U16.3), MCU (U1.87)
ETH_PHY_LED0 / AF10: Communication Connectors (R36.1), MCU (U1.77)
ETH_PHY_LED1 / AF10: Communication Connectors (R35.1), MCU (U1.79)
I2C4_SCL / AF2: Communication Connectors (CN17.4 CN18.4 R34.2), MCU (U1.49)
I2C4_SDA / AF2: Communication Connectors (CN17.3 CN18.3 R33.2), MCU (U1.50)
LDSW_CTR: MCU (U1.117), USB Connectors (R13.1)
MDIR_N: Communication Connectors (CN19.6), MCU (U1.12)
MDIR_P: Communication Connectors (CN19.3), MCU (U1.13)
MDIT_N: Communication Connectors (CN19.2), MCU (U1.14)
MDIT_P: Communication Connectors (CN19.1), MCU (U1.15)
OTG_FS_D_N: MCU (CN3.1 U1.89), USB Connectors (CN10.A7 CN10.B7 U7.6)
OTG_FS_D_P: MCU (CN2.2 U1.90), USB Connectors (CN10.A6 CN10.B6 U7.4)
PE10: MCU (U1.55), Memory (U11.6)
PE11: MCU (U1.56), Memory (U11.1)
PE12: MCU (U1.57), Memory (U11.5)
PE13: MCU (U1.58), Memory (U11.2)
PE14: MCU (U1.59), Memory (R20.2 U11.3)
PE15: MCU (U1.60), Memory (R19.1 U11.7)
QSPI1_SCK / AF9: MCU (U1.47), Memory (U10.6)
QSPI1_SCSN / AF10: MCU (U1.118), Memory (U10.1)
QSPI1_SIO0 / AF10: MCU (U1.19), Memory (U10.5)
QSPI1_SIO1 / AF10: MCU (U1.20), Memory (U10.2)
QSPI1_SIO2 / AF10: MCU (U1.18), Memory (R18.2 U10.3)
QSPI1_SIO3 / AF10: MCU (U1.17), Memory (R17.1 U10.7)
SDMMC_CMD: MCU (U1.101), Memory (CN11.3 U9.2 U9.9)
SDMMC_D0: MCU (U1.85), Memory (CN11.7 U8.1 U8.10)
SDMMC_D1: MCU (U1.86), Memory (CN11.8 U8.2 U8.9)
SDMMC_D2: MCU (U1.96), Memory (CN11.1 U8.4 U8.7)
SDMMC_D3: MCU (U1.97), Memory (CN11.2 U8.5 U8.6)
SDMMC_DET: MCU (U1.100), Memory (CN11.CD U9.5 U9.6)
SDMMC_SDCK: MCU (U1.98), Memory (CN11.5 U9.1 U9.10)
SPI4_MISO / AF5: Communication Connectors (CN16.3), MCU (U1.4)
SPI4_MOSI / AF5: Communication Connectors (CN16.4), MCU (U1.5)
SPI4_NSS / AF5: Communication Connectors (CN16.6), MCU (U1.3)
SPI4_SCK / AF5: Communication Connectors (CN16.5), MCU (U1.1)
USART3_RX / AF7: Communication Connectors (U18.1), MCU (U1.70)
USART3_TX / AF7: Communication Connectors (U18.4), MCU (U1.69)
USART4_RX / AF7: Communication Connectors (U16.1), MCU (U1.84)
USART4_TX / AF7: Communication Connectors (U16.4), MCU (U1.83)
USBHS_D_N: MCU (CN1.7 U1.121), USB Connectors (CN9.A7 CN9.B7 U5.4)
USBHS_D_P: MCU (CN1.9 U1.120), USB Connectors (CN9.A6 CN9.B6 U5.6)
USBSS_RX_N: MCU (U1.126), USB Connectors (CN9.A11 CN9.B11 U6.4 U6.7)
USBSS_RX_P: MCU (U1.127), USB Connectors (CN9.A10 CN9.B10 U6.5 U6.6)
USBSS_TX_N: MCU (C14.2), USB Connectors (CN9.A3 CN9.B3 U6.2 U6.9)
USBSS_TX_P: MCU (C15.2), USB Connectors (CN9.A2 CN9.B2 U6.1 U6.10)